# EAGLE design numpad (EAGLE 9.6.1)
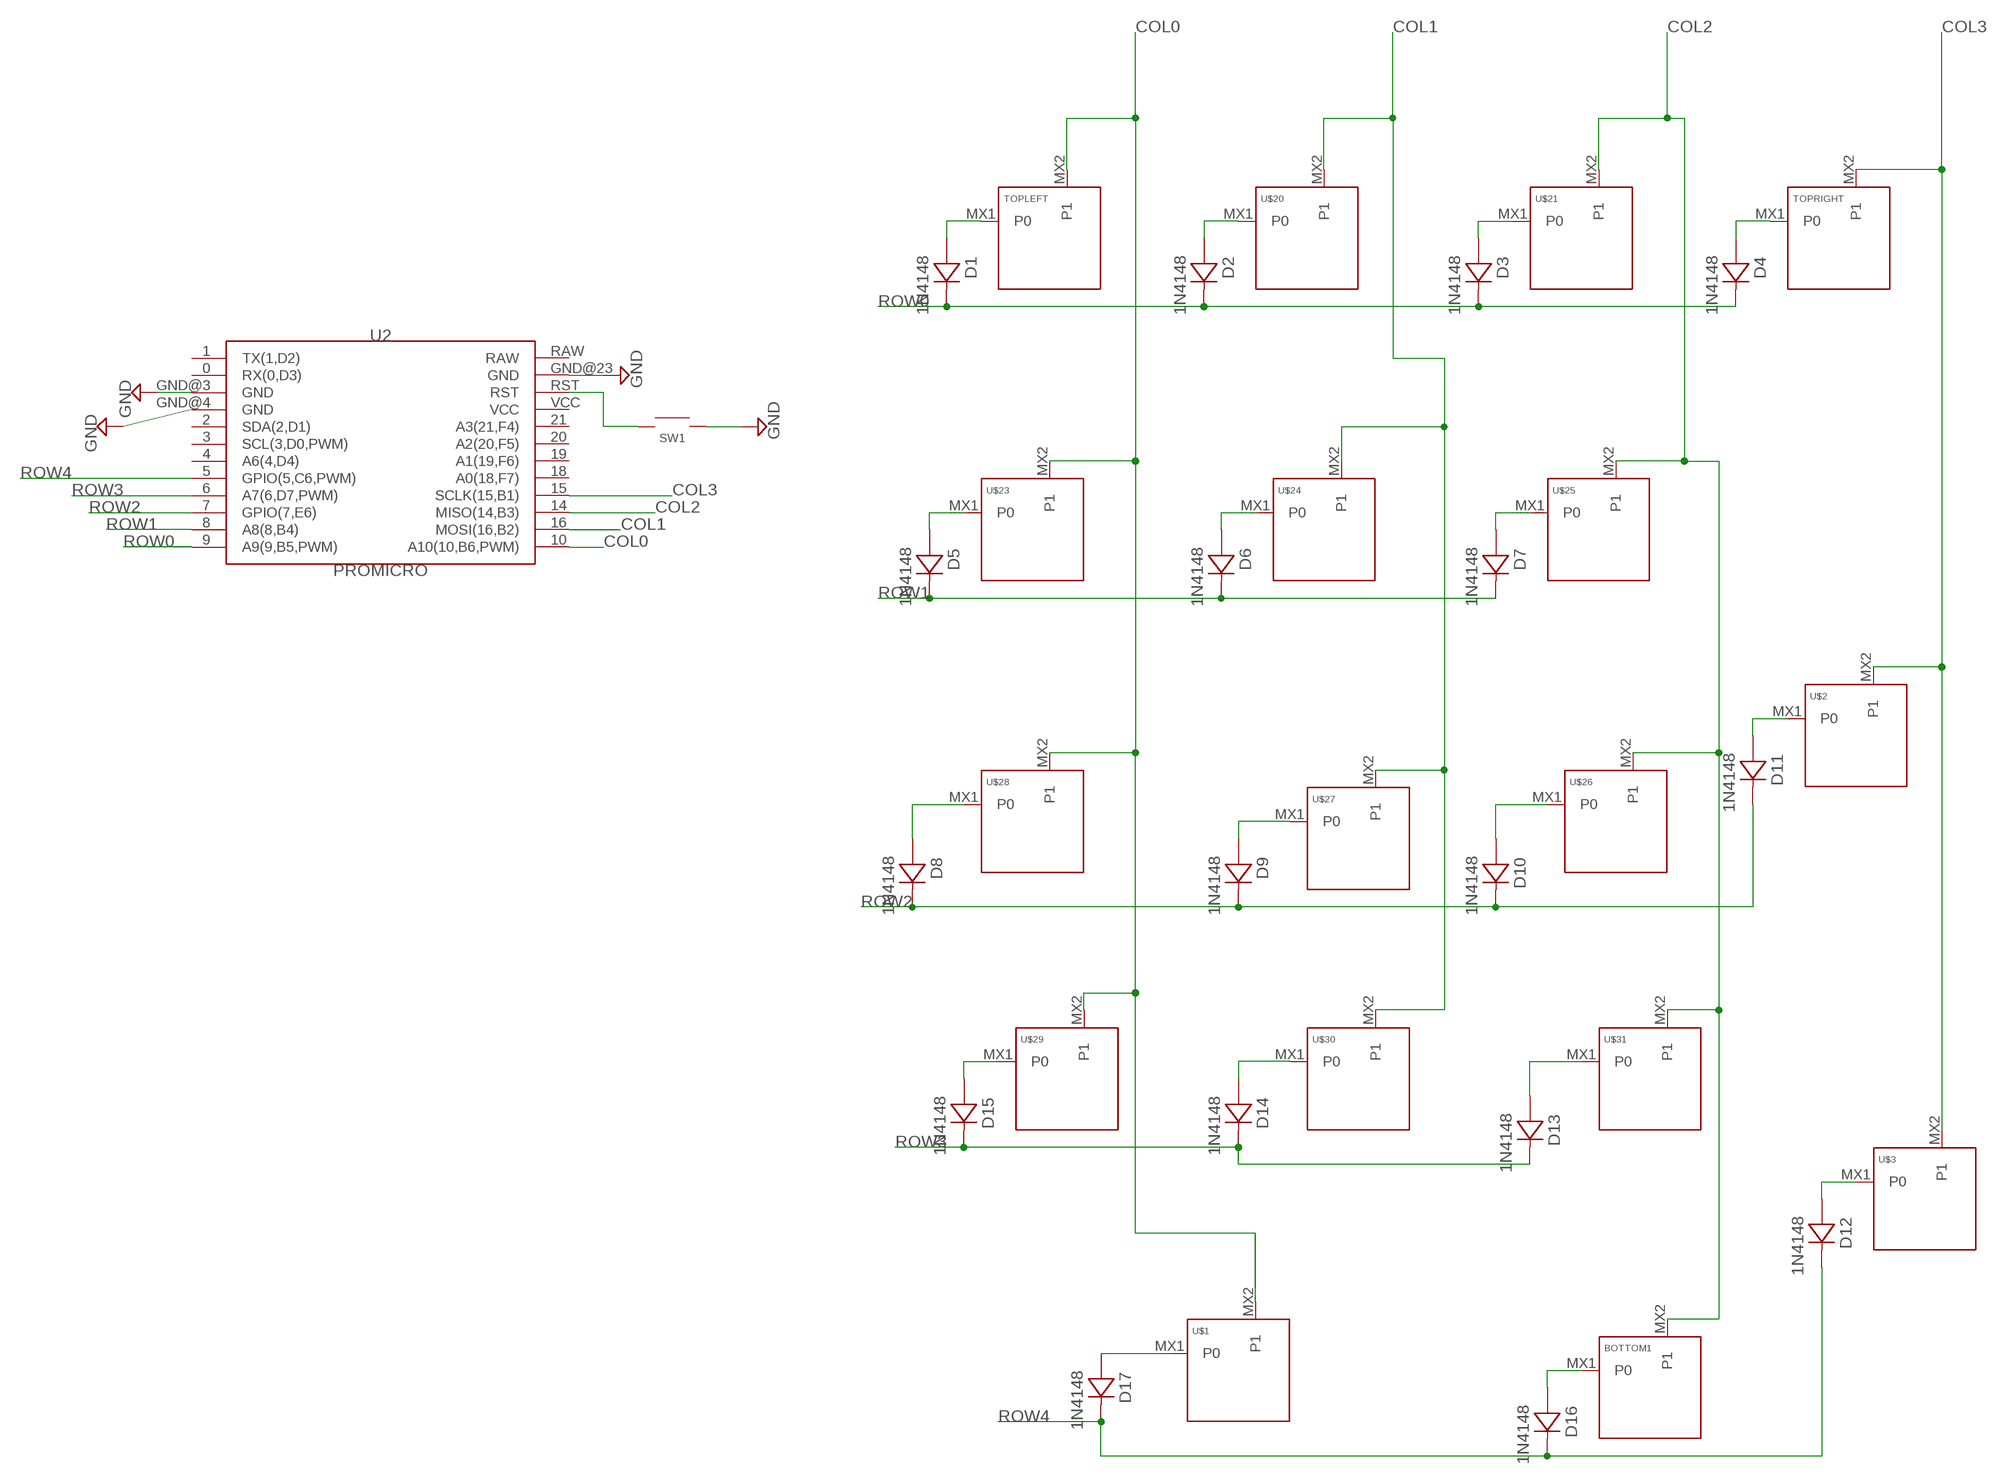
[diagram p0: schematic, sheet 1]

## Parts
BOTTOM1  KEYSWITCH-PLAIN-MX-1U  [MX-1U]
D1  1N4148  DIODE-DO-35  [DO-35]
D2  1N4148  DIODE-DO-35  [DO-35]
D3  1N4148  DIODE-DO-35  [DO-35]
D4  1N4148  DIODE-DO-35  [DO-35]
D5  1N4148  DIODE-DO-35  [DO-35]
D6  1N4148  DIODE-DO-35  [DO-35]
D7  1N4148  DIODE-DO-35  [DO-35]
D8  1N4148  DIODE-DO-35  [DO-35]
D9  1N4148  DIODE-DO-35  [DO-35]
D10  1N4148  DIODE-DO-35  [DO-35]
D11  1N4148  DIODE-DO-35  [DO-35]
D12  1N4148  DIODE-DO-35  [DO-35]
D13  1N4148  DIODE-DO-35  [DO-35]
D14  1N4148  DIODE-DO-35  [DO-35]
D15  1N4148  DIODE-DO-35  [DO-35]
D16  1N4148  DIODE-DO-35  [DO-35]
D17  1N4148  DIODE-DO-35  [DO-35]
SW1  SWITCH-SMD-SCHURTER-1241.1612.11  [SWITCH-SMD-SCHURTER-1241.1612.11]
TOPLEFT  KEYSWITCH-PLAIN-MX-1U  [MX-1U]
TOPRIGHT  KEYSWITCH-PLAIN-MX-1U  [MX-1U]
U2  PROMICRO  [PROMICRO]
U$1  KEYSWITCH-PLAIN-MX-2U-FLIPPED  [MX-2U-FLIPPED]
U$2  KEYSWITCH-PLAIN-MX-2U-ROTATED  [MX-2U-ROTATED]
U$3  KEYSWITCH-PLAIN-MX-2U-ROTATED  [MX-2U-ROTATED]
U$20  KEYSWITCH-PLAIN-MX-1U  [MX-1U]
U$21  KEYSWITCH-PLAIN-MX-1U  [MX-1U]
U$23  KEYSWITCH-PLAIN-MX-1U  [MX-1U]
U$24  KEYSWITCH-PLAIN-MX-1U  [MX-1U]
U$25  KEYSWITCH-PLAIN-MX-1U  [MX-1U]
U$26  KEYSWITCH-PLAIN-MX-1U  [MX-1U]
U$27  KEYSWITCH-PLAIN-MX-1U  [MX-1U]
U$28  KEYSWITCH-PLAIN-MX-1U  [MX-1U]
U$29  KEYSWITCH-PLAIN-MX-1U  [MX-1U]
U$30  KEYSWITCH-PLAIN-MX-1U  [MX-1U]
U$31  KEYSWITCH-PLAIN-MX-1U  [MX-1U]

## Nets
COL0: TOPLEFT.MX2(P1) U2.10(A10(10,B6,PWM)) U$1.MX2(P1) U$23.MX2(P1) U$28.MX2(P1) U$29.MX2(P1)
COL1: U2.16(MOSI(16,B2)) U$20.MX2(P1) U$24.MX2(P1) U$27.MX2(P1) U$30.MX2(P1)
COL2: BOTTOM1.MX2(P1) U2.14(MISO(14,B3)) U$21.MX2(P1) U$25.MX2(P1) U$26.MX2(P1) U$31.MX2(P1)
COL3: TOPRIGHT.MX2(P1) U2.15(SCLK(15,B1)) U$2.MX2(P1) U$3.MX2(P1)
GND: SW1.2A SW1.2B U2.GND@3(GND) U2.GND@4(GND) U2.GND@23(GND)
N$1: SW1.1A SW1.1B U2.RST
N$2: D1.A TOPLEFT.MX1(P0)
N$3: D2.A U$20.MX1(P0)
N$4: D3.A U$21.MX1(P0)
N$5: D4.A TOPRIGHT.MX1(P0)
N$6: D15.A U$29.MX1(P0)
N$8: D5.A U$23.MX1(P0)
N$10: D6.A U$24.MX1(P0)
N$11: D7.A U$25.MX1(P0)
N$12: D11.A U$2.MX1(P0)
N$13: D10.A U$26.MX1(P0)
N$14: D9.A U$27.MX1(P0)
N$15: D8.A U$28.MX1(P0)
N$17: D14.A U$30.MX1(P0)
N$18: D13.A U$31.MX1(P0)
N$19: BOTTOM1.MX1(P0) D16.A
N$20: D17.A U$1.MX1(P0)
N$21: D12.A U$3.MX1(P0)
ROW0: D1.C D2.C D3.C D4.C U2.9(A9(9,B5,PWM))
ROW1: D5.C D6.C D7.C U2.8(A8(8,B4))
ROW2: D8.C D9.C D10.C D11.C U2.7(GPIO(7,E6))
ROW3: D13.C D14.C D15.C U2.6(A7(6,D7,PWM))
ROW4: D12.C D16.C D17.C U2.5(GPIO(5,C6,PWM))
Unconnected: U2.0(RX(0,D3)) U2.1(TX(1,D2)) U2.2(SDA(2,D1)) U2.3(SCL(3,D0,PWM)) U2.4(A6(4,D4)) U2.18(A0(18,F7)) U2.19(A1(19,F6)) U2.20(A2(20,F5)) U2.21(A3(21,F4)) U2.RAW U2.VCC

## Library data of the parts
BOTTOM1 TOPLEFT TOPRIGHT U$1-U$3 U$20 U$21 U$23-U$31 = Keyboard:KEYSWITCH-PLAIN
D1-D17 = Components:DIODE: Standard 1N4148 diode
SW1 = Hardware:SWITCH-SMD
U2 = MCU:PROMICRO

## Board
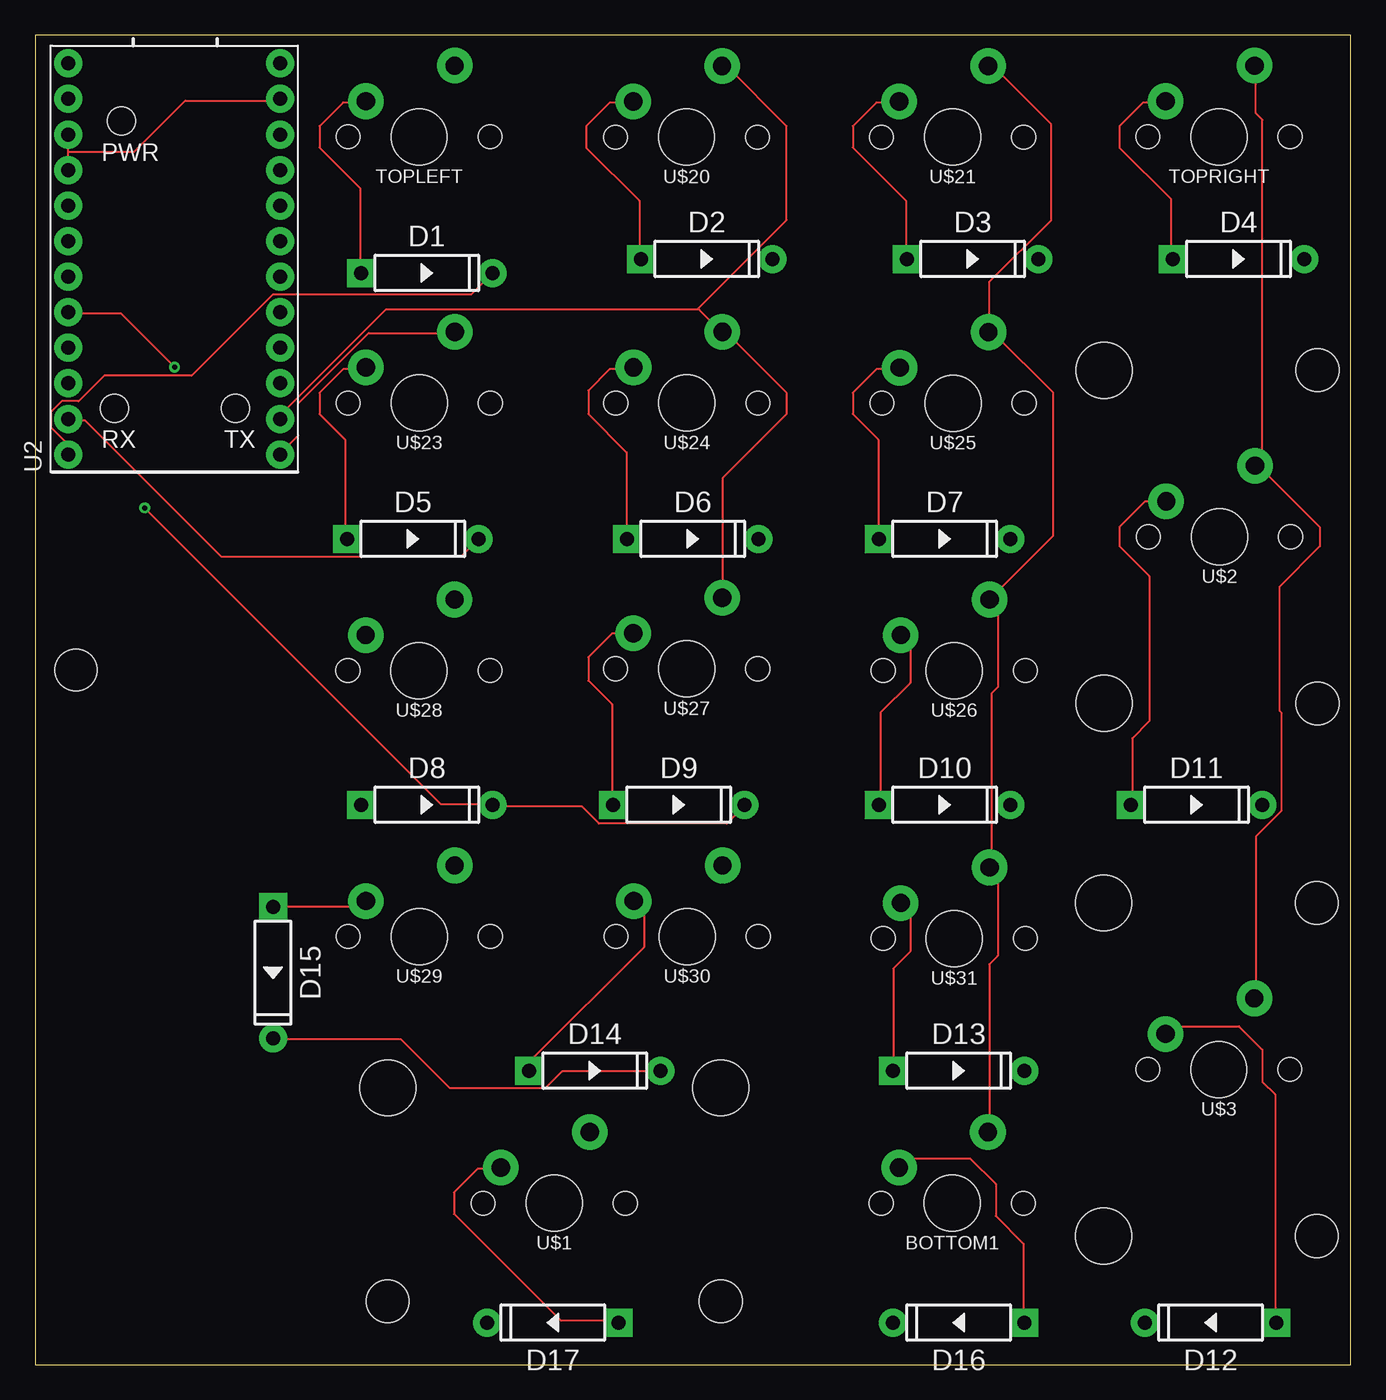
[diagram p1: board, top side]
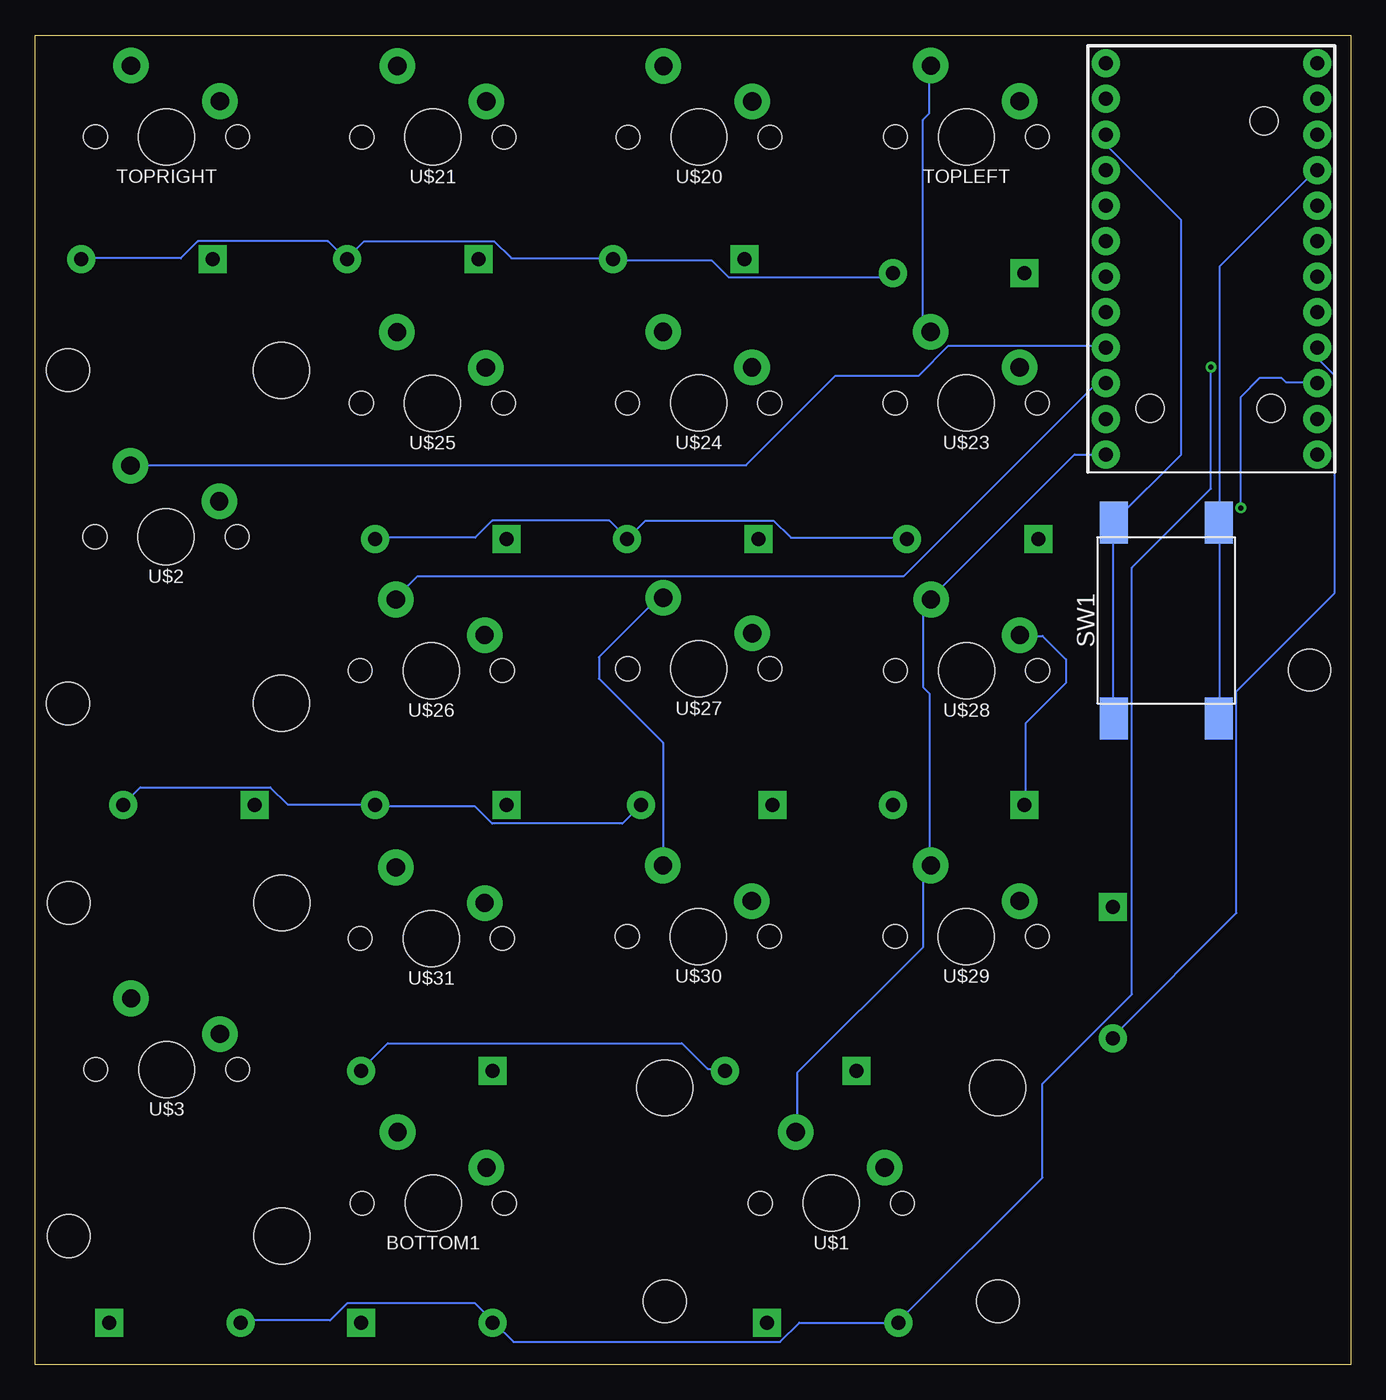
[diagram p2: board, bottom side, seen from below]

Size 94 x 95 mm. Coordinates in mm from the lower left corner, seen from the top.
Outline: 0,0 94,0 94,95 0,95 0,0
Copper layers (1*16): Top 0.035mm / dielectric 1.5mm / Bottom 0.035mm
Design rules "default": minimum track width 6mil, minimum drill 0.35mm, track to track 6mil, track to pad 6mil, pad to pad 6mil, via to via 6mil, smd to smd 6mil, copper to edge 40mil, drill to drill 6mil, minimum pad ring 10mil, minimum via ring 8mil, stop-mask expansion 4mil, vias tented up to drill 0mil, thermal gap 10mil
Holes 3 mm at 2.94,49.63

### Footprints (pad centres in the part's own frame; a part is rotated, then mirrored left to right if it is on the bottom)
MX-1U = drill 1.3 pad 2.54: MX1 -3.81,2.54; MX2 2.54,5.08 | hole 4: 0,0 | hole 1.7: -5.08,0; 5.08,0
DO-35 = drill 1 pad 2 square: A -4.705,0 | drill 1 pad 2: C 4.705,0
SWITCH-SMD-SCHURTER-1241.1612.11 = smd 3 x 2: 1A -7,-3.75; 1B 7,-3.75; 2A -7,3.75; 2B 7,3.75
PROMICRO = drill 1 pad 2: 0 -7.62,11.43; 1 -7.62,13.97; 2 -7.62,3.81; 3 -7.62,1.27; 4 -7.62,-1.27; 5 -7.62,-3.81; 6 -7.62,-6.35; 7 -7.62,-8.89; 8 -7.62,-11.43; 9 -7.62,-13.97; 10 7.5,-13.97; 14 7.5,-8.89; 15 7.5,-6.35; 16 7.5,-11.43; 18 7.5,-3.81; 19 7.5,-1.27; 20 7.5,1.27; 21 7.5,3.81; GND@3 -7.62,8.89; GND@4 -7.62,6.35; GND@23 7.5,11.43; RAW 7.5,13.97; RST 7.5,8.89; VCC 7.5,6.35 | hole 2: -3.82,9.87; -4.318,-10.67; 4.318,-10.67
MX-2U-FLIPPED = drill 1.3 pad 2.54: MX1 -3.81,2.54; MX2 2.54,5.08 | hole 4: 0,0; -11.9,8.24; 11.9,8.24 | hole 1.7: -5.08,0; 5.08,0 | hole 3.05: -11.9,-7; 11.9,-7
MX-2U-ROTATED = drill 1.3 pad 2.54: MX1 -3.81,2.54; MX2 2.54,5.08 | hole 4: 0,0; -8.24,-11.9; -8.24,11.9 | hole 1.7: -5.08,0; 5.08,0 | hole 3.05: 7,-11.9; 7,11.9

### Placement (x,y rotation side)
BOTTOM1  65.55,11.53 0 top
D1  28,78 0 top
D2  48,79 0 top
D3  67,79 0 top
D4  86,79 0 top
D5  27,59 0 top
D6  47,59 0 top
D7  65,59 0 top
D8  28,40 0 top
D9  46,40 0 top
D10  65,40 0 top
D11  83,40 0 top
D12  84,3 180 top
D13  66,21 0 top
D14  40,21 0 top
D15  17,28 270 top
D16  66,3 180 top
D17  37,3 180 top
SW1  13.17,53.17 270 bottom
TOPLEFT  27.45,87.73 0 top
TOPRIGHT  84.6,87.73 0 top
U2  10,79 0 top
U$1  37.1,11.53 0 top
U$2  84.64,59.14 0 top
U$3  84.59,21.08 0 top
U$20  46.55,87.71 0 top
U$21  65.57,87.71 0 top
U$23  27.45,68.71 0 top
U$24  46.58,68.71 0 top
U$25  65.59,68.69 0 top
U$26  65.68,49.58 0 top
U$27  46.57,49.71 0 top
U$28  27.44,49.58 0 top
U$29  27.45,30.58 0 top
U$30  46.59,30.58 0 top
U$31  65.68,30.44 0 top

### Tracks (layer width: path | path; a pad name or v marks a point on that pad's centre or on a via)
COL0
  Top 0.152: U$23.MX2 29.94,73.7 23.84,73.7 18.81,68.68 18.81,66.39 17.59,65.17 U2.10
  Bottom 0.152: U2.10 17.59,65.02 19.73,65.02 29.94,54.81 U$28.MX2 30.09,54.66 30.55,54.2 30.55,48.41 30.09,47.95 30.09,35.76 U$29.MX2 30.09,35.6 30.55,35.15 30.55,29.81 39.54,20.82 39.54,16.71 U$1.MX2 | TOPLEFT.MX2 30.09,92.75 30.09,89.4 30.55,88.94 30.55,74.31 30.09,73.86 U$23.MX2
COL1
  Top 0.152: 47.31,75.38 47.46,75.38 48.99,73.86 U$24.MX2 49.14,73.7 49.44,73.7 53.71,69.44 53.71,67.91 49.14,63.34 49.14,54.81 U$27.MX2 | 47.31,75.38 25.06,75.38 17.59,67.91 17.59,67.61 U2.16 | 47.31,75.38 53.71,81.78 53.71,88.49 49.44,92.75 49.14,92.75 U$20.MX2
  Bottom 0.152: U$30.MX2 49.14,35.76 49.14,44.44 53.71,49.02 53.71,50.54 49.6,54.66 49.14,54.66 U$27.MX2
COL2
  Top 0.152: BOTTOM1.MX2 68.19,16.71 68.19,28.59 68.8,29.2 68.8,35 68.34,35.45 U$31.MX2 68.34,35.6 68.34,47.95 68.8,48.41 68.8,54.2 68.34,54.66 U$26.MX2 68.34,54.81 72.76,59.23 72.76,69.44 68.49,73.7 68.19,73.7 U$25.MX2 68.19,73.86 68.19,77.36 72.61,81.78 72.61,88.64 68.49,92.75 68.19,92.75 U$21.MX2
  Bottom 0.152: U2.14 17.59,70.05 18.2,70.05 31.92,56.33 66.67,56.33 68.19,54.81 U$26.MX2
COL3
  Top 0.152: 87.7,63.95 87.54,64.1 87.24,64.1 U$2.MX2 87.7,63.95 | 87.7,63.95 91.81,59.84 91.81,58.47 88.92,55.57 88.92,46.73 89.07,46.58 89.07,39.57 87.24,37.74 87.24,26.31 U$3.MX2 | 87.7,63.95 87.7,88.94 87.24,89.4 87.24,92.75 TOPRIGHT.MX2
  Bottom 0.152: U2.15 17.59,72.79 28.72,72.79 30.85,70.66 36.8,70.66 43.2,64.26 87.09,64.26 U$2.MX2
GND
  Top 0.152: 2.35,86.66 2.35,87.88 U2.GND@3 | 2.35,86.66 2.35,85.44 U2.GND@4 | 2.35,86.66 7.08,86.66 10.73,90.32 17.44,90.32 U2.GND@23
  Bottom 0.152: SW1.2B 9.36,46.27 9.36,60.14 SW1.2A 9.36,60.29 9.36,78.43 2.5,85.29 U2.GND@4
N$1
  Bottom 0.152: SW1.1B 16.98,46.27 16.98,60.14 SW1.1A 16.83,60.29 12.11,65.02 12.11,81.78 17.44,87.12 17.44,87.88 U2.RST
N$2
  Top 0.152: D1.A 23.23,78.12 23.23,84.07 20.34,86.96 20.34,88.49 22.01,90.16 23.54,90.16 TOPLEFT.MX1
N$3
  Top 0.152: D2.A 43.2,79.04 43.2,83.15 39.39,86.96 39.39,88.49 41.06,90.16 42.74,90.16 U$20.MX1
N$4
  Top 0.152: D3.A 62.25,79.04 62.25,83.15 58.44,86.96 58.44,88.49 60.11,90.16 61.64,90.16 U$21.MX1
N$5
  Top 0.152: D4.A 81.14,79.04 81.14,83.31 77.49,86.96 77.49,88.49 79.16,90.16 80.69,90.16 TOPRIGHT.MX1
N$6
  Top 0.152: D15.A 17.14,32.71 23.23,32.71 23.54,33.01 U$29.MX1
N$8
  Top 0.152: D5.A 22.16,59.08 22.16,66.08 20.34,67.91 20.34,69.44 22.01,71.11 23.54,71.11 U$23.MX1
N$10
  Top 0.152: D6.A 42.28,59.08 42.28,65.17 39.54,67.91 39.54,69.59 41.06,71.11 42.74,71.11 U$24.MX1
N$11
  Top 0.152: D7.A 60.27,59.08 60.27,66.08 58.44,67.91 58.44,69.44 60.11,71.11 61.64,71.11 U$25.MX1
N$12
  Top 0.152: D11.A 78.4,40.02 78.4,44.75 79.62,45.97 79.62,56.33 77.49,58.47 77.49,59.84 79.31,61.67 80.69,61.67 U$2.MX1
N$13
  Top 0.152: D10.A 60.42,40.02 60.42,46.58 62.55,48.71 62.55,51.45 61.94,52.06 U$26.MX1
N$14
  Top 0.152: D9.A 41.22,40.02 41.22,47.19 39.54,48.86 39.54,50.54 41.22,52.22 42.74,52.22 U$27.MX1
N$15
  Bottom 0.152: D8.A 23.23,40.02 23.23,45.82 20.34,48.71 20.34,50.39 22.01,52.06 23.54,52.06 U$28.MX1
N$17
  Top 0.152: D14.A 35.42,21.13 35.42,21.74 43.5,29.81 43.5,32.41 42.89,33.01 U$30.MX1
N$18
  Top 0.152: D13.A 61.33,21.13 61.33,28.29 62.55,29.51 62.55,32.25 61.94,32.86 U$31.MX1
N$19
  Top 0.152: BOTTOM1.MX1 62.4,14.73 66.82,14.73 68.65,12.9 68.65,10.61 70.63,8.63 70.63,3.14 D16.A
N$20
  Top 0.152: D17.A 41.67,3.14 37.56,3.14 29.94,10.76 29.94,12.29 31.61,13.96 33.29,13.96 U$1.MX1
N$21
  Top 0.152: D12.A 88.61,3.14 88.61,19.3 87.7,20.21 87.7,22.5 86.02,24.18 81.3,24.18 80.84,23.72 U$3.MX1
ROW0
  Top 0.152: U2.9 2.35,65.17 2.35,65.78 1.13,67 1.13,68.07 1.9,68.83 3.12,68.83 4.94,70.66 11.19,70.66 16.98,76.45 31.16,76.45 32.68,77.97 D1.C
  Bottom 0.152: D4.C 90.59,79.04 83.58,79.04 82.36,80.26 73.07,80.26 71.85,79.04 D3.C 71.69,79.04 70.48,80.26 61.18,80.26 59.96,79.04 52.8,79.04 D2.C 52.65,78.89 45.63,78.89 44.41,77.67 33.14,77.67 32.83,77.97 D1.C
ROW1
  Top 0.152: U2.8 2.5,67.46 3.57,67.46 13.33,57.7 30.39,57.7 31.61,58.92 D5.C
  Bottom 0.152: D5.C 31.77,59.08 40,59.08 41.22,60.29 50.36,60.29 51.58,59.08 D6.C 51.73,59.08 52.95,60.29 61.33,60.29 62.55,59.08 69.56,59.08 D7.C
ROW2  (via drill 0.35)
  Top 0.152: D9.C 50.66,39.87 49.44,38.65 40.3,38.65 39.08,39.87 32.83,39.87 D8.C 32.68,40.02 29.02,40.02 v7.84,61.21
  Bottom 0.152: D11.C 87.7,40.02 86.48,41.24 77.18,41.24 75.96,40.02 69.71,40.02 D10.C 69.56,39.87 62.55,39.87 61.33,38.65 52.03,38.65 50.82,39.87 D9.C | v7.84,61.21 7.84,69.13 6.47,70.5 4.94,70.5 4.64,70.2 2.5,70.2 U2.7
ROW3
  Top 0.152: D14.C 44.57,20.98 37.71,20.98 36.49,19.76 29.63,19.76 26.13,23.26 17.14,23.26 D15.C
  Bottom 0.152: D14.C 44.72,21.13 45.94,21.13 47.77,22.96 68.8,22.96 70.63,21.13 D13.C | U2.6 2.35,72.64 2.35,71.88 1.13,70.66 1.13,55.11 8.14,48.1 8.14,32.25 16.98,23.41 D15.C
ROW4  (via drill 0.35)
  Top 0.152: v9.97,71.27 6.16,75.08 2.5,75.08 U2.5
  Bottom 0.152: v9.97,71.27 9.97,62.58 15.61,56.94 15.61,26.46 22.01,20.06 22.01,13.36 32.22,3.14 D17.C 32.38,2.99 39.39,2.99 40.76,1.62 59.81,1.62 61.18,2.99 D16.C 61.33,3.14 62.55,4.36 71.69,4.36 72.91,3.14 79.16,3.14 D12.C